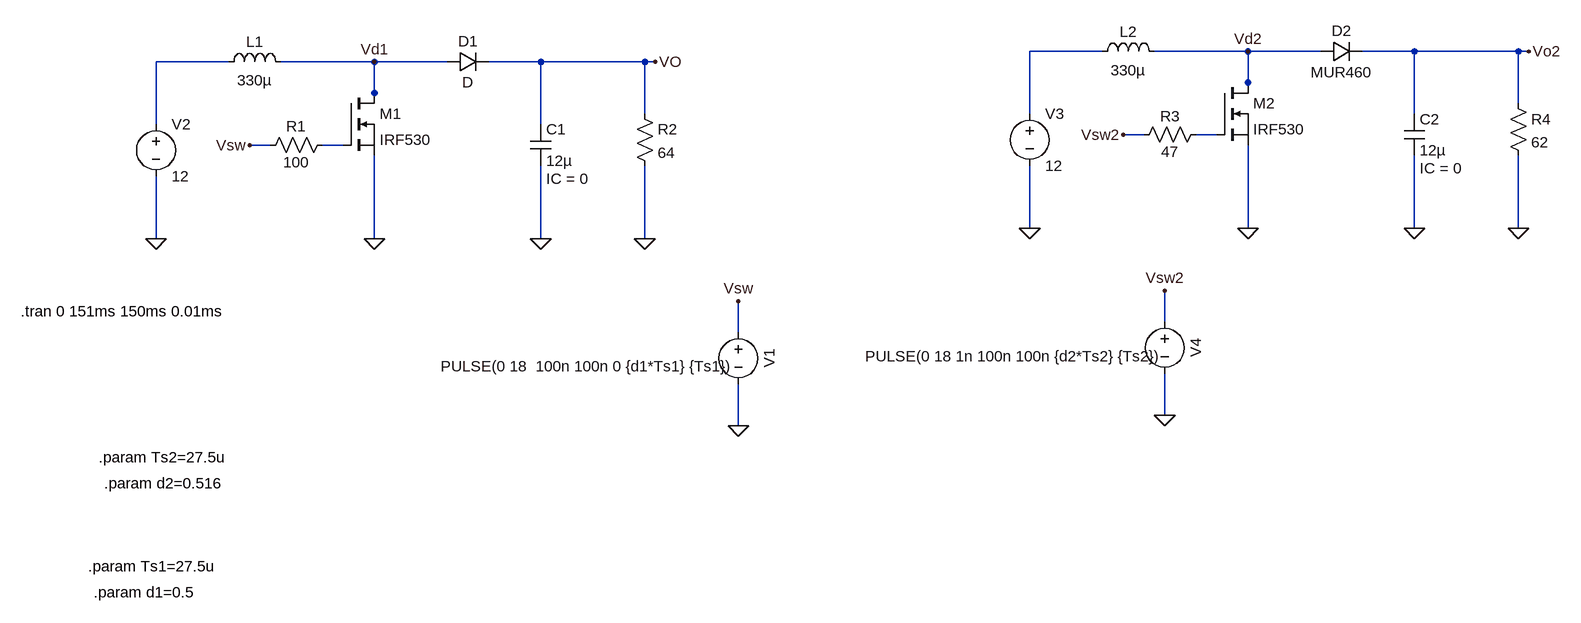
[diagram p0: schematic Boost.asc]
Boost.asc, the LTspice schematic file:
Version 4
SHEET 1 2312 944
WIRE 1488 96 1376 96
WIRE 1712 96 1568 96
WIRE 1824 96 1712 96
WIRE 1968 96 1888 96
WIRE 2128 96 1968 96
WIRE 2144 96 2128 96
WIRE 144 112 32 112
WIRE 368 112 224 112
WIRE 480 112 368 112
WIRE 624 112 544 112
WIRE 784 112 624 112
WIRE 800 112 784 112
WIRE 1712 144 1712 96
WIRE 368 160 368 112
WIRE 1712 160 1712 144
WIRE 368 176 368 160
WIRE 2128 176 2128 96
WIRE 784 192 784 112
WIRE 1376 192 1376 96
WIRE 1968 192 1968 96
WIRE 32 208 32 112
WIRE 624 208 624 112
WIRE 1552 224 1520 224
WIRE 1664 224 1632 224
WIRE 208 240 176 240
WIRE 320 240 288 240
WIRE 1376 368 1376 272
WIRE 1712 368 1712 240
WIRE 1968 368 1968 256
WIRE 2128 368 2128 256
WIRE 32 384 32 288
WIRE 368 384 368 256
WIRE 624 384 624 272
WIRE 784 384 784 272
WIRE 1584 512 1584 464
WIRE 928 528 928 480
WIRE 1584 656 1584 592
WIRE 928 672 928 608
FLAG 624 384 0
FLAG 32 384 0
FLAG 800 112 VO
FLAG 784 384 0
FLAG 928 672 0
FLAG 928 480 Vsw
FLAG 368 384 0
FLAG 176 240 Vsw
FLAG 1968 368 0
FLAG 1376 368 0
FLAG 2144 96 Vo2
FLAG 2128 368 0
FLAG 1712 368 0
FLAG 1520 224 Vsw2
FLAG 1584 656 0
FLAG 1584 464 Vsw2
FLAG 368 112 Vd1
FLAG 1712 96 Vd2
SYMBOL ind 128 128 R270
WINDOW 3 3 56 VBottom 2
WINDOW 0 31 56 VTop 2
WINDOW 123 3 56 VTop 2
SYMATTR Value 330µ
SYMATTR InstName L1
SYMBOL cap 608 208 R0
WINDOW 123 24 84 Left 2
SYMATTR Value2 IC = 0
SYMATTR InstName C1
SYMATTR Value 12µ
SYMBOL voltage 32 192 R0
WINDOW 123 0 0 Left 0
WINDOW 39 0 0 Left 0
SYMATTR InstName V2
SYMATTR Value 12
SYMBOL voltage 928 512 M0
WINDOW 0 -32 56 VBottom 2
WINDOW 3 231 53 Top 2
WINDOW 123 0 0 Left 0
WINDOW 39 0 0 Left 0
SYMATTR InstName V1
SYMATTR Value PULSE(0 18  100n 100n 0 {d1*Ts1} {Ts1})
SYMBOL nmos 320 160 R0
SYMATTR InstName M1
SYMATTR Value IRF530
SYMBOL res 304 224 R90
WINDOW 0 3 56 VBottom 2
WINDOW 3 27 56 VTop 2
SYMATTR InstName R1
SYMATTR Value 100
SYMBOL ind 1472 112 R270
WINDOW 3 3 56 VBottom 2
WINDOW 0 31 56 VTop 2
WINDOW 123 3 56 VTop 2
SYMATTR Value 330µ
SYMATTR InstName L2
SYMBOL cap 1952 192 R0
WINDOW 123 24 84 Left 2
SYMATTR Value2 IC = 0
SYMATTR InstName C2
SYMATTR Value 12µ
SYMBOL voltage 1376 176 R0
WINDOW 123 0 0 Left 0
WINDOW 39 0 0 Left 0
SYMATTR InstName V3
SYMATTR Value 12
SYMBOL diode 1824 112 R270
WINDOW 0 32 32 VTop 2
WINDOW 3 0 32 VBottom 2
SYMATTR InstName D2
SYMATTR Value MUR460
SYMBOL nmos 1664 144 R0
SYMATTR InstName M2
SYMATTR Value IRF530
SYMBOL res 1648 208 R90
WINDOW 0 3 56 VBottom 2
WINDOW 3 27 56 VTop 2
SYMATTR InstName R3
SYMATTR Value 47
SYMBOL res 2112 160 R0
SYMATTR InstName R4
SYMATTR Value 62
SYMBOL voltage 1584 496 M0
WINDOW 0 -32 56 VBottom 2
WINDOW 3 231 53 Top 2
WINDOW 123 0 0 Left 0
WINDOW 39 0 0 Left 0
SYMATTR InstName V4
SYMATTR Value PULSE(0 18 1n 100n 100n {d2*Ts2} {Ts2})
SYMBOL res 768 176 R0
SYMATTR InstName R2
SYMATTR Value 64
SYMBOL diode 480 128 R270
WINDOW 0 32 32 VTop 2
WINDOW 3 0 32 VBottom 2
SYMATTR InstName D1
TEXT -176 496 Left 2 !.tran 0 151ms 150ms 0.01ms
TEXT -56 720 Left 2 !.param Ts2=27.5u
TEXT -48 760 Left 2 !.param d2=0.516
TEXT -72 888 Left 2 !.param Ts1=27.5u
TEXT -64 928 Left 2 !.param d1=0.5

The netlist it stands for:
* Boost.asc
L1 N002 Vd1 330µ
C1 VO 0 12µ IC = 0
V2 N002 0 12
V1 Vsw 0 PULSE(0 18  100n 100n 0 {d1*Ts1} {Ts1})
M1 Vd1 N004 0 0 IRF530
R1 N004 Vsw 100
L2 N001 Vd2 330µ
C2 Vo2 0 12µ IC = 0
V3 N001 0 12
D2 Vd2 Vo2 MUR460
M2 Vd2 N003 0 0 IRF530
R3 N003 Vsw2 47
R4 Vo2 0 62
V4 Vsw2 0 PULSE(0 18 1n 100n 100n {d2*Ts2} {Ts2})
R2 VO 0 64
D1 Vd1 VO D
.model D D
.lib standard.dio
.model NMOS NMOS
.model PMOS PMOS
.lib standard.mos
.tran 0 151ms 150ms 0.01ms
.param Ts2=27.5u
.param d2=0.516
.param Ts1=27.5u
.param d1=0.5
.backanno
.end